# EAGLE design BUS_4TEE_1 (EAGLE 6.5.0)
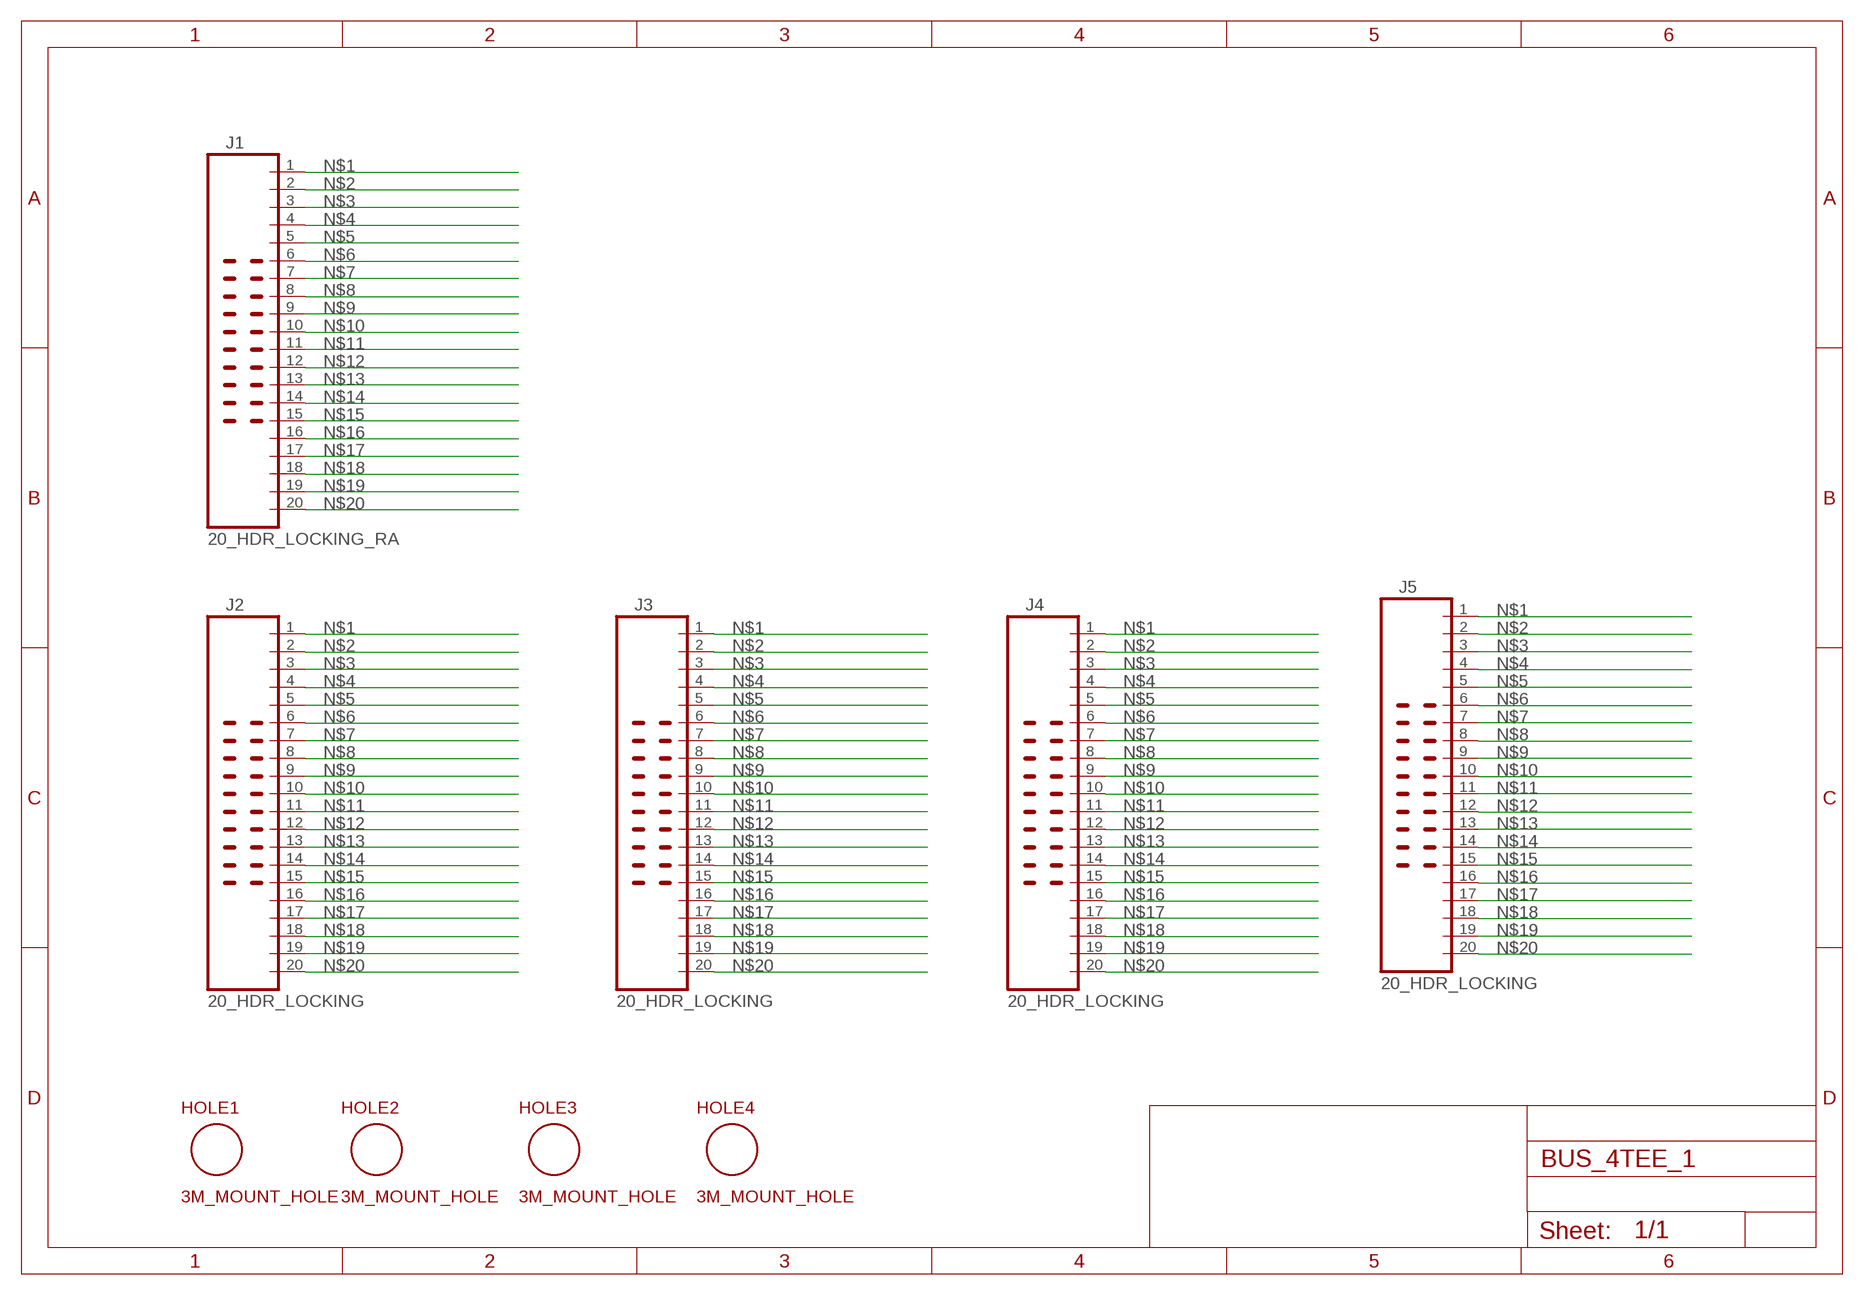
[diagram p0: schematic, sheet 1]

## Parts
HOLE1  3M_MOUNT_HOLE  [3M_HOLE]
HOLE2  3M_MOUNT_HOLE  [3M_HOLE]
HOLE3  3M_MOUNT_HOLE  [3M_HOLE]
HOLE4  3M_MOUNT_HOLE  [3M_HOLE]
J1  20_HDR_LOCKING_RA  [20_HDR_LOCKING_RA]
J2  20_HDR_LOCKING  [20_HDR_LOCKING]
J3  20_HDR_LOCKING  [20_HDR_LOCKING]
J4  20_HDR_LOCKING  [20_HDR_LOCKING]
J5  20_HDR_LOCKING  [20_HDR_LOCKING]

## Nets
N$1: J1.1 J2.1 J3.1 J4.1 J5.1
N$2: J1.2 J2.2 J3.2 J4.2 J5.2
N$3: J1.3 J2.3 J3.3 J4.3 J5.3
N$4: J1.4 J2.4 J3.4 J4.4 J5.4
N$5: J1.5 J2.5 J3.5 J4.5 J5.5
N$6: J1.6 J2.6 J3.6 J4.6 J5.6
N$7: J1.7 J2.7 J3.7 J4.7 J5.7
N$8: J1.8 J2.8 J3.8 J4.8 J5.8
N$9: J1.9 J2.9 J3.9 J4.9 J5.9
N$10: J1.10 J2.10 J3.10 J4.10 J5.10
N$11: J1.11 J2.11 J3.11 J4.11 J5.11
N$12: J1.12 J2.12 J3.12 J4.12 J5.12
N$13: J1.13 J2.13 J3.13 J4.13 J5.13
N$14: J1.14 J2.14 J3.14 J4.14 J5.14
N$15: J1.15 J2.15 J3.15 J4.15 J5.15
N$16: J1.16 J2.16 J3.16 J4.16 J5.16
N$17: J1.17 J2.17 J3.17 J4.17 J5.17
N$18: J1.18 J2.18 J3.18 J4.18 J5.18
N$19: J1.19 J2.19 J3.19 J4.19 J5.19
N$20: J1.20 J2.20 J3.20 J4.20 J5.20

## Library data of the parts
HOLE1-HOLE4 = MyLib:3M_MOUNT_HOLE
J1 = MyLib:20_HDR_LOCKING_RA
J2-J5 = MyLib:20_HDR_LOCKING

## Board
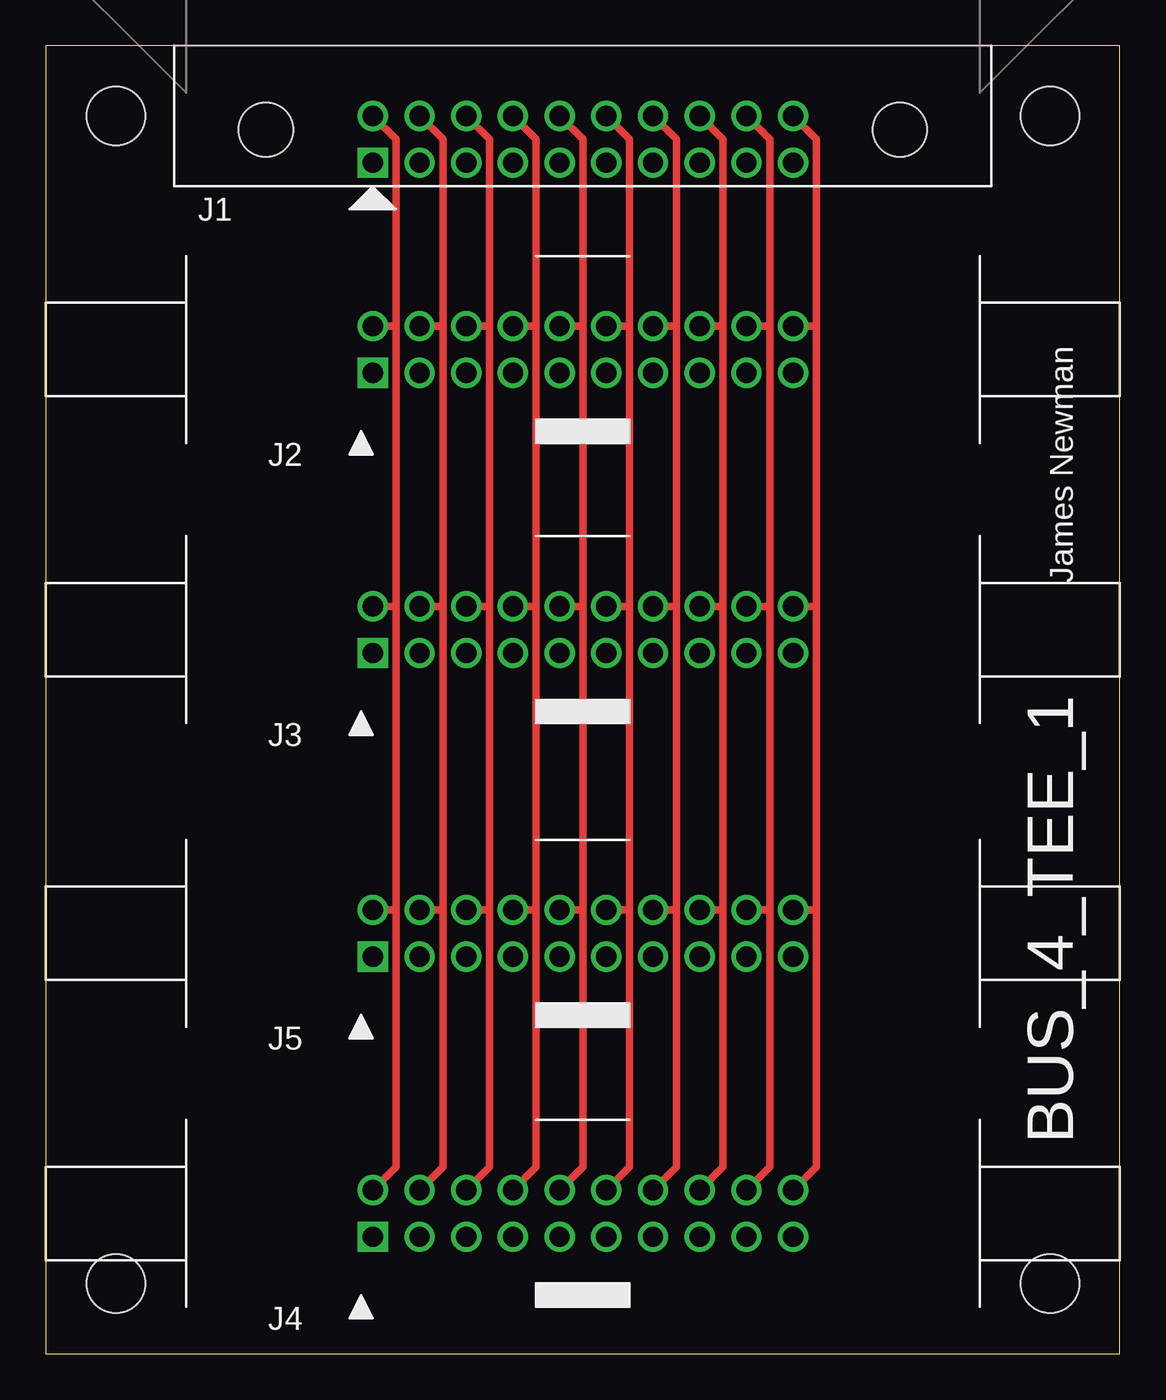
[diagram p1: board, top side]
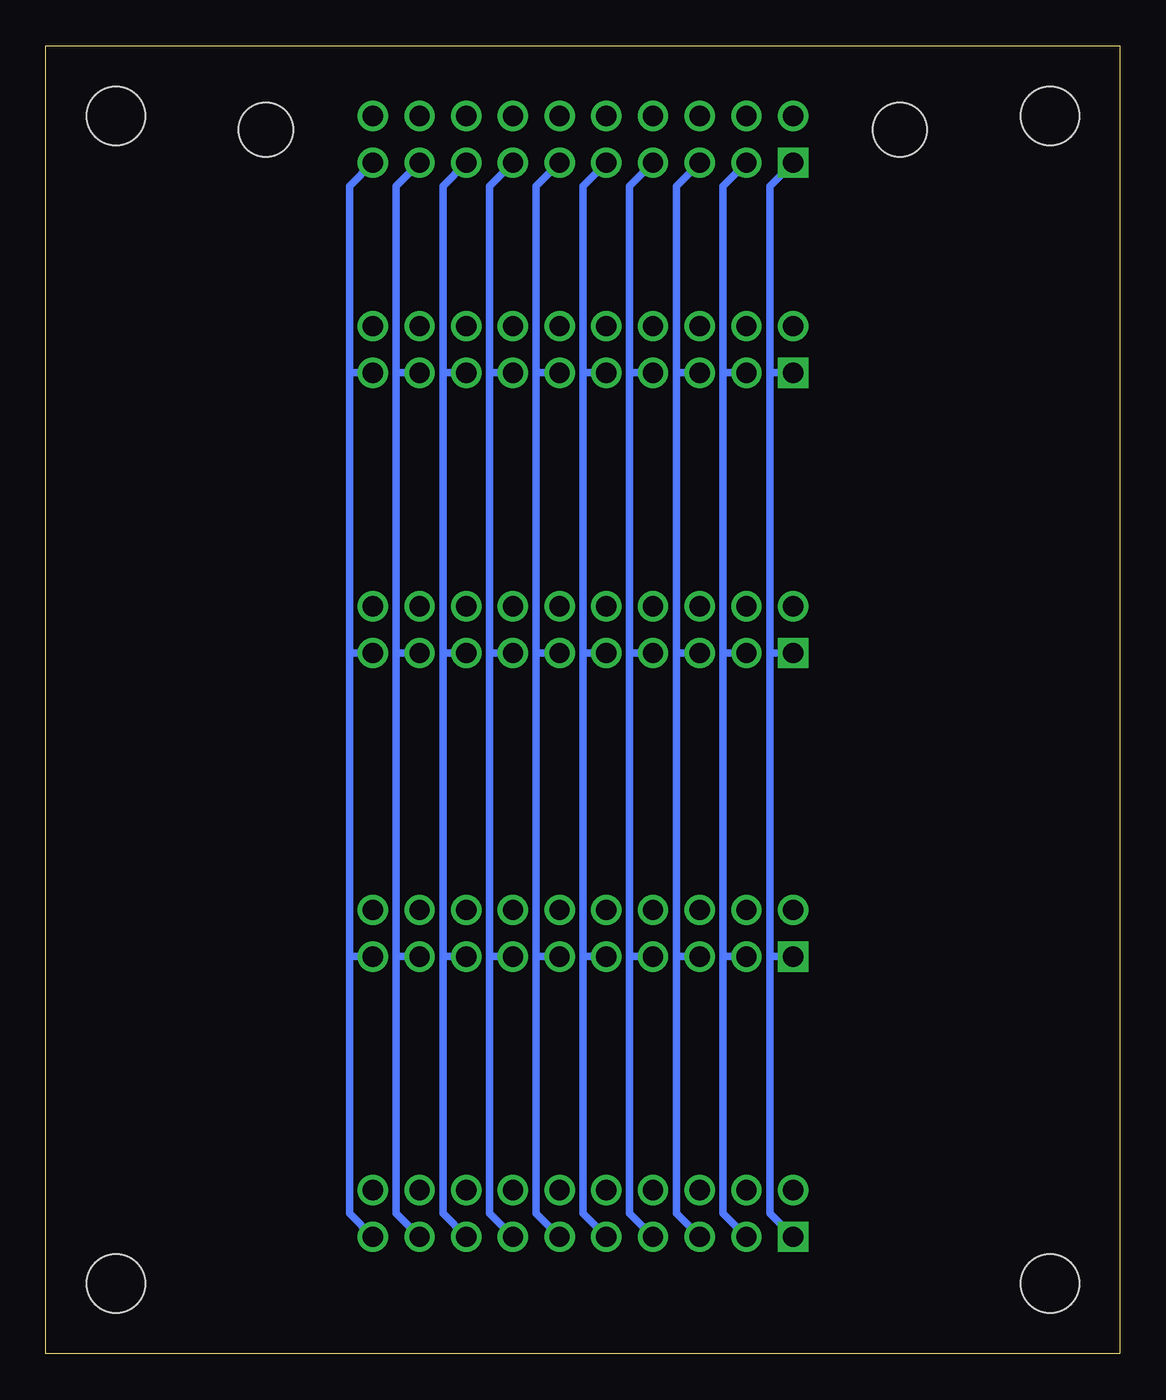
[diagram p2: board, bottom side, seen from below]

Size 58.42 x 71.12 mm. Coordinates in mm from the lower left corner, seen from the top.
Outline: 0,0 58.42,0 58.42,71.12 0,71.12 0,0
Copper layers (1*16): Top 0.035mm / dielectric 1.5mm / Bottom 0.035mm
Design rules "default": minimum track width 10mil, minimum drill 24mil, track to track 8mil, track to pad 8mil, pad to pad 8mil, via to via 8mil, smd to smd 8mil, copper to edge 40mil, drill to drill 8mil, minimum pad ring 10mil, minimum via ring 8mil, stop-mask expansion 4mil, vias tented up to drill 0mil, thermal gap 10mil

### Footprints (pad centres in the part's own frame; a part is rotated, then mirrored left to right if it is on the bottom)
3M_HOLE = hole 3.2: 0,0
20_HDR_LOCKING_RA = drill 1.1 square: 1 -11.43,-1.27 | drill 1.1: 2 -11.43,1.27; 3 -8.89,-1.27; 4 -8.89,1.27; 5 -6.35,-1.27; 6 -6.35,1.27; 7 -3.81,-1.27; 8 -3.81,1.27; 9 -1.27,-1.27; 10 -1.27,1.27; 11 1.27,-1.27; 12 1.27,1.27; 13 3.81,-1.27; 14 3.81,1.27; 15 6.35,-1.27; 16 6.35,1.27; 17 8.89,-1.27; 18 8.89,1.27; 19 11.43,-1.27; 20 11.43,1.27 | hole 2.946: -17.247,0.533; 17.247,0.533
20_HDR_LOCKING = drill 1.1 square: 1 -1.27,11.43 | drill 1.1: 2 1.27,11.43; 3 -1.27,8.89; 4 1.27,8.89; 5 -1.27,6.35; 6 1.27,6.35; 7 -1.27,3.81; 8 1.27,3.81; 9 -1.27,1.27; 10 1.27,1.27; 11 -1.27,-1.27; 12 1.27,-1.27; 13 -1.27,-3.81; 14 1.27,-3.81; 15 -1.27,-6.35; 16 1.27,-6.35; 17 -1.27,-8.89; 18 1.27,-8.89; 19 -1.27,-11.43; 20 1.27,-11.43

### Placement (x,y rotation side)
HOLE1  3.81,3.81 0 top
HOLE2  54.61,3.81 0 top
HOLE3  3.81,67.31 0 top
HOLE4  54.61,67.31 0 top
J1  29.21,66.04 0 top
J2  29.21,54.61 90 top
J3  29.21,39.37 90 top
J4  29.21,7.62 90 top
J5  29.21,22.86 90 top

### Tracks (layer width: path | path; a pad name or v marks a point on that pad's centre or on a via)
N$1
  Bottom 0.406: J4.1 19.05,7.62 19.05,21.59 | 19.05,21.59 19.05,38.1 | 19.05,38.1 19.05,53.34 | 19.05,53.34 19.05,63.5 J1.1 | J3.1 19.05,38.1 | J2.1 19.05,53.34 | J5.1 19.05,21.59
N$2
  Top 0.406: J1.2 19.05,66.04 19.05,55.88 | 19.05,55.88 19.05,40.64 | 19.05,40.64 19.05,24.13 | 19.05,24.13 19.05,10.16 J4.2 | J5.2 19.05,24.13 | J2.2 19.05,55.88 | J3.2 19.05,40.64
N$3
  Bottom 0.406: J4.3 21.59,7.62 21.59,21.59 | 21.59,21.59 21.59,38.1 | 21.59,38.1 21.59,53.34 | 21.59,53.34 21.59,63.5 J1.3 | J3.3 21.59,38.1 | J2.3 21.59,53.34 | J5.3 21.59,21.59
N$4
  Top 0.406: J4.4 21.59,10.16 21.59,24.13 | 21.59,24.13 21.59,40.64 | 21.59,40.64 21.59,55.88 | 21.59,55.88 21.59,66.04 J1.4 | J5.4 21.59,24.13 | J2.4 21.59,55.88 | J3.4 21.59,40.64
N$5
  Bottom 0.406: J4.5 24.13,7.62 24.13,21.59 | 24.13,21.59 24.13,38.1 | 24.13,38.1 24.13,53.34 | 24.13,53.34 24.13,63.5 J1.5 | J3.5 24.13,38.1 | J2.5 24.13,53.34 | J5.5 24.13,21.59
N$6
  Top 0.406: J1.6 24.13,66.04 24.13,55.88 | 24.13,55.88 24.13,40.64 | 24.13,40.64 24.13,24.13 | 24.13,24.13 24.13,10.16 J4.6 | J5.6 24.13,24.13 | J2.6 24.13,55.88 | J3.6 24.13,40.64
N$7
  Bottom 0.406: J4.7 26.67,7.62 26.67,21.59 | 26.67,21.59 26.67,38.1 | 26.67,38.1 26.67,53.34 | 26.67,53.34 26.67,63.5 J1.7 | J3.7 26.67,38.1 | J2.7 26.67,53.34 | J5.7 26.67,21.59
N$8
  Top 0.406: J4.8 26.67,10.16 26.67,24.13 | 26.67,24.13 26.67,40.64 | 26.67,40.64 26.67,55.88 | 26.67,55.88 26.67,66.04 J1.8 | J5.8 26.67,24.13 | J2.8 26.67,55.88 | J3.8 26.67,40.64
N$9
  Bottom 0.406: J4.9 29.21,7.62 29.21,21.59 | 29.21,21.59 29.21,38.1 | 29.21,38.1 29.21,53.34 | 29.21,53.34 29.21,63.5 J1.9 | J3.9 29.21,38.1 | J2.9 29.21,53.34 | J5.9 29.21,21.59
N$10
  Top 0.406: J1.10 29.21,66.04 29.21,55.88 | 29.21,55.88 29.21,40.64 | 29.21,40.64 29.21,24.13 | 29.21,24.13 29.21,10.16 J4.10 | J5.10 29.21,24.13 | J2.10 29.21,55.88 | J3.10 29.21,40.64
N$11
  Bottom 0.406: J4.11 31.75,7.62 31.75,21.59 | 31.75,21.59 31.75,38.1 | 31.75,38.1 31.75,53.34 | 31.75,53.34 31.75,63.5 J1.11 | J3.11 31.75,38.1 | J2.11 31.75,53.34 | J5.11 31.75,21.59
N$12
  Top 0.406: J1.12 31.75,66.04 31.75,55.88 | 31.75,55.88 31.75,40.64 | 31.75,40.64 31.75,24.13 | 31.75,24.13 31.75,10.16 J4.12 | J5.12 31.75,24.13 | J2.12 31.75,55.88 | J3.12 31.75,40.64
N$13
  Bottom 0.406: J4.13 34.29,7.62 34.29,21.59 | 34.29,21.59 34.29,38.1 | 34.29,38.1 34.29,53.34 | 34.29,53.34 34.29,63.5 J1.13 | J3.13 34.29,38.1 | J2.13 34.29,53.34 | J5.13 34.29,21.59
N$14
  Top 0.406: J1.14 34.29,66.04 34.29,55.88 | 34.29,55.88 34.29,40.64 | 34.29,40.64 34.29,24.13 | 34.29,24.13 34.29,10.16 J4.14 | J5.14 34.29,24.13 | J2.14 34.29,55.88 | J3.14 34.29,40.64
N$15
  Bottom 0.406: J4.15 36.83,7.62 36.83,21.59 | 36.83,21.59 36.83,38.1 | 36.83,38.1 36.83,53.34 | 36.83,53.34 36.83,63.5 J1.15 | J3.15 36.83,38.1 | J2.15 36.83,53.34 | J5.15 36.83,21.59
N$16
  Top 0.406: J1.16 36.83,66.04 36.83,55.88 | 36.83,55.88 36.83,40.64 | 36.83,40.64 36.83,24.13 | 36.83,24.13 36.83,10.16 J4.16 | J5.16 36.83,24.13 | J2.16 36.83,55.88 | J3.16 36.83,40.64
N$17
  Bottom 0.406: J4.17 39.37,7.62 39.37,21.59 | 39.37,21.59 39.37,38.1 | 39.37,38.1 39.37,53.34 | 39.37,53.34 39.37,63.5 J1.17 | J3.17 39.37,38.1 | J2.17 39.37,53.34 | J5.17 39.37,21.59
N$18
  Top 0.406: J1.18 39.37,66.04 39.37,55.88 | 39.37,55.88 39.37,40.64 | 39.37,40.64 39.37,24.13 | 39.37,24.13 39.37,10.16 J4.18 | J5.18 39.37,24.13 | J2.18 39.37,55.88 | J3.18 39.37,40.64
N$19
  Bottom 0.406: J4.19 41.91,7.62 41.91,21.59 | 41.91,21.59 41.91,38.1 | 41.91,38.1 41.91,53.34 | 41.91,53.34 41.91,63.5 J1.19 | J3.19 41.91,38.1 | J2.19 41.91,53.34 | J5.19 41.91,21.59
N$20
  Top 0.406: J1.20 41.91,66.04 41.91,55.88 | 41.91,55.88 41.91,40.64 | 41.91,40.64 41.91,24.13 | 41.91,24.13 41.91,10.16 J4.20 | J5.20 41.91,24.13 | J2.20 41.91,55.88 | J3.20 41.91,40.64

### Text on the board
tPlace: James Newman | BUS_4_TEE_1